# EAGLE design FiftyOneFun (EAGLE 9.2.2)
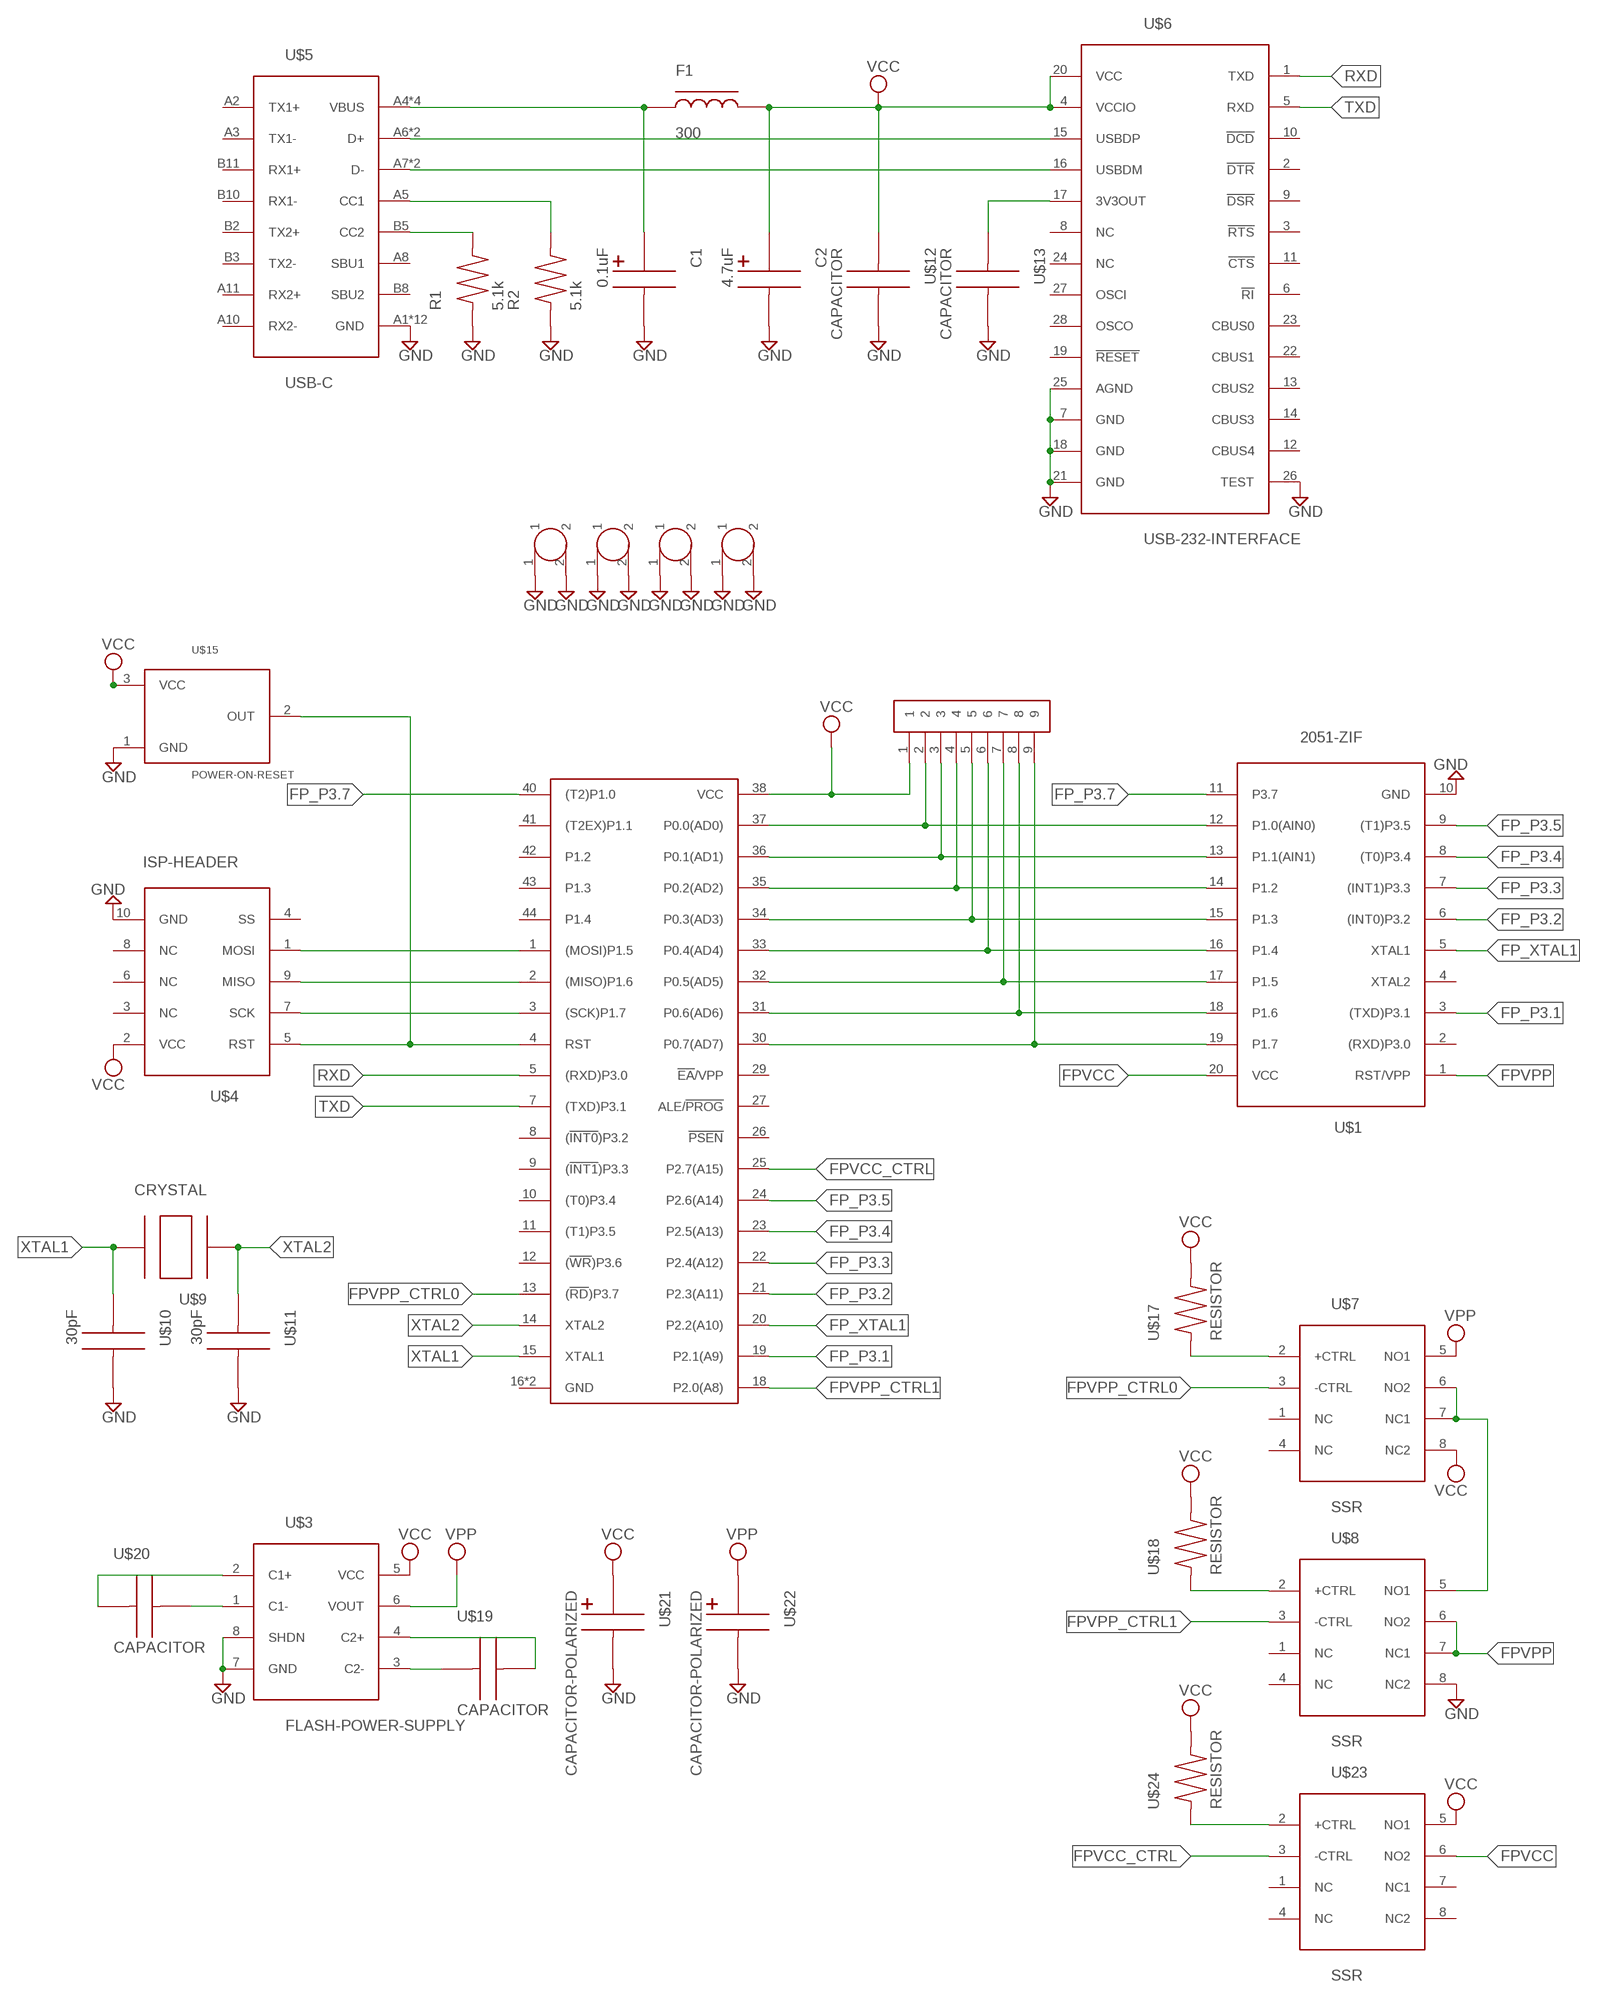
[diagram p0: schematic, sheet 1]

## Parts
C1  0.1uF  CAPACITOR-POLARIZED  [CAPACITOR-POLARIZED]
C2  4.7uF  CAPACITOR-POLARIZED  [CAPACITOR-POLARIZED]
F1  300  FERRITE-BEAD  [FERRITE-BEAD]
R1  5.1k  RESISTOR  [RESISTOR]
R2  5.1k  RESISTOR  [RESISTOR]
U$1  2051-ZIF  [2051-ZIF]
U$2  SIP-RESISTORS  [SIP-RESISTORS]
U$3  FLASH-POWER-SUPPLY  [FLASH-POWER-SUPPLY]
U$4  ISP-HEADER  [ISP-HEADER]
U$5  USB-C  [12401598E4#2A]
U$6  USB-232-INTERFACE  [USB-232-INTERFACE]
U$7  SSR  [SSR]
U$8  SSR  [SSR]
U$9  CRYSTAL  [CRYSTAL]
U$10  30pF  CAPACITOR  [CAPACITOR]
U$11  30pF  CAPACITOR  [CAPACITOR]
U$12  CAPACITOR  [CAPACITOR]
U$13  CAPACITOR  [CAPACITOR]
U$14  8052  [8052]
U$15  POWER-ON-RESET  [POWER-ON-RESET]
U$16  MOUNTING-HOLE  [MOUNTING-HOLE]
U$17  RESISTOR  [RESISTOR]
U$18  RESISTOR  [RESISTOR]
U$19  CAPACITOR  [CAPACITOR]
U$20  CAPACITOR  [CAPACITOR]
U$21  CAPACITOR-POLARIZED  [CAPACITOR-POLARIZED]
U$22  CAPACITOR-POLARIZED  [CAPACITOR-POLARIZED]
U$23  SSR  [SSR]
U$24  RESISTOR  [RESISTOR]
U$25  MOUNTING-HOLE  [MOUNTING-HOLE]
U$26  MOUNTING-HOLE  [MOUNTING-HOLE]
U$27  MOUNTING-HOLE  [MOUNTING-HOLE]

## Nets
FP_P3.1: U$1.3((TXD)P3.1) U$14.19(P2.1(A9))
FP_P3.2: U$1.6((INT0)P3.2) U$14.21(P2.3(A11))
FP_P3.3: U$1.7((INT1)P3.3) U$14.22(P2.4(A12))
FP_P3.4: U$1.8((T0)P3.4) U$14.23(P2.5(A13))
FP_P3.5: U$1.9((T1)P3.5) U$14.24(P2.6(A14))
FP_P3.7: U$1.11(P3.7) U$14.40((T2)P1.0)
FP_XTAL1: U$1.5(XTAL1) U$14.20(P2.2(A10))
FPD0: U$1.12(P1.0(AIN0)) U$2.2 U$14.37(P0.0(AD0))
FPD1: U$1.13(P1.1(AIN1)) U$2.3 U$14.36(P0.1(AD1))
FPD2: U$1.14(P1.2) U$2.4 U$14.35(P0.2(AD2))
FPD3: U$1.15(P1.3) U$2.5 U$14.34(P0.3(AD3))
FPD4: U$1.16(P1.4) U$2.6 U$14.33(P0.4(AD4))
FPD5: U$1.17(P1.5) U$2.7 U$14.32(P0.5(AD5))
FPD6: U$1.18(P1.6) U$2.8 U$14.31(P0.6(AD6))
FPD7: U$1.19(P1.7) U$2.9 U$14.30(P0.7(AD7))
FPVCC: U$1.20(VCC) U$23.6(NO2)
FPVCC_CTRL: U$14.25(P2.7(A15)) U$23.3(-CTRL)
FPVPP: U$1.1(RST/VPP) U$8.6(NO2) U$8.7(NC1)
FPVPP_CTRL0: U$7.3(-CTRL) U$14.13((!RD!)P3.7)
FPVPP_CTRL1: U$8.3(-CTRL) U$14.18(P2.0(A8))
GND: C1.2 C2.2 R1.1 R2.1 U$1.10(GND) U$3.7(GND) U$3.8(SHDN) U$4.10(GND) U$5.A1(GND) U$5.A12(GND) U$5.B1(GND) U$5.B12(GND) U$5.MOUNT_1_BOTTOM(GND) U$5.MOUNT_1_TOP(GND) U$5.MOUNT_2_BOTTOM(GND) U$5.MOUNT_2_TOP(GND) U$5.MOUNT_3_BOTTOM(GND) U$5.MOUNT_3_TOP(GND) U$5.MOUNT_4_BOTTOM(GND) U$5.MOUNT_4_TOP(GND) U$6.7(GND) U$6.18(GND) U$6.21(GND) U$6.25(AGND) U$6.26(TEST) U$8.8(NC2) U$10.2 U$11.2 U$12.2 U$13.2 U$15.1(GND) U$16.1 U$16.2 U$21.2 U$22.2 U$25.1 U$25.2 U$26.1 U$26.2 U$27.1 U$27.2
MISO: U$4.9(MISO) U$14.2((MISO)P1.6)
MOSI: U$4.1(MOSI) U$14.1((MOSI)P1.5)
N$3: U$3.1(C1-) U$20.2
N$4: U$3.3(C2-) U$19.1
N$5: U$3.4(C2+) U$19.2
N$6: R1.2 U$5.B5(CC2)
N$7: R2.2 U$5.A5(CC1)
N$9: U$3.2(C1+) U$20.1
N$10: U$5.A6(D+) U$5.B6(D+) U$6.15(USBDP)
N$11: U$5.A7(D-) U$5.B7(D-) U$6.16(USBDM)
N$12: U$6.17(3V3OUT) U$13.1
N$13: U$7.2(+CTRL) U$17.1
N$14: U$8.2(+CTRL) U$18.1
N$19: U$7.6(NO2) U$7.7(NC1) U$8.5(NO1)
N$31: U$23.2(+CTRL) U$24.1
RST: U$4.5(RST) U$14.4(RST) U$15.2(OUT)
RXD: U$6.1(TXD) U$14.5((RXD)P3.0)
SCK: U$4.7(SCK) U$14.3((SCK)P1.7)
TXD: U$6.5(RXD) U$14.7((TXD)P3.1)
VBUS: C1.1 F1.1 U$5.A4(VBUS) U$5.A9(VBUS) U$5.B4(VBUS) U$5.B9(VBUS)
VCC: C2.1 F1.2 U$2.1 U$3.5(VCC) U$4.2(VCC) U$6.4(VCCIO) U$6.20(VCC) U$7.8(NC2) U$12.1 U$14.38(VCC) U$15.3(VCC) U$17.2 U$18.2 U$21.1 U$23.5(NO1) U$24.2
VPP: U$3.6(VOUT) U$7.5(NO1) U$22.1
XTAL1: U$9.2 U$10.1 U$14.15(XTAL1)
XTAL2: U$9.1 U$11.1 U$14.14(XTAL2)
Unconnected: U$1.2((RXD)P3.0) U$1.4(XTAL2) U$4.3(NC) U$4.4(SS) U$4.6(NC) U$4.8(NC) U$5.A2(TX1+) U$5.A3(TX1-) U$5.A8(SBU1) U$5.A10(RX2-) U$5.A11(RX2+) U$5.B2(TX2+) U$5.B3(TX2-) U$5.B8(SBU2) U$5.B10(RX1-) U$5.B11(RX1+) U$6.2(!DTR) U$6.3(!RTS) U$6.6(!RI) U$6.8(NC) U$6.9(!DSR) U$6.10(!DCD) U$6.11(!CTS) U$6.12(CBUS4) U$6.13(CBUS2) U$6.14(CBUS3) U$6.19(!RESET) U$6.22(CBUS1) U$6.23(CBUS0) U$6.24(NC) U$6.27(OSCI) U$6.28(OSCO) U$7.1(NC) U$7.4(NC) U$8.1(NC) U$8.4(NC) U$14.8((!INT0!)P3.2) U$14.9((!INT1!)P3.3) U$14.10((T0)P3.4) U$14.11((T1)P3.5) U$14.12((!WR!)P3.6) U$14.16(GND) U$14.17(GND) U$14.26(!PSEN) U$14.27(ALE/!PROG) U$14.29(!EA!/VPP) U$14.41((T2EX)P1.1) U$14.42(P1.2) U$14.43(P1.3) U$14.44(P1.4) U$23.1(NC) U$23.4(NC) U$23.7(NC1) U$23.8(NC2)

## Library data of the parts
C1 C2 U$21 U$22 = FiftyOneFunParts:CAPACITOR-POLARIZED
F1 = FiftyOneFunParts:FERRITE-BEAD
R1 R2 U$17 U$18 U$24 = FiftyOneFunParts:RESISTOR
U$1 = FiftyOneFunParts:2051-ZIF
U$2 = FiftyOneFunParts:SIP-RESISTORS
U$3 = FiftyOneFunParts:FLASH-POWER-SUPPLY
U$4 = FiftyOneFunParts:ISP-HEADER
U$5 = FiftyOneFunParts:USB-C
U$6 = FiftyOneFunParts:USB-232-INTERFACE
U$7 U$8 U$23 = FiftyOneFunParts:SSR
U$9 = FiftyOneFunParts:CRYSTAL
U$10-U$13 U$19 U$20 = FiftyOneFunParts:CAPACITOR
U$14 = FiftyOneFunParts:8052
U$15 = FiftyOneFunParts:POWER-ON-RESET
U$16 U$25-U$27 = FiftyOneFunParts:MOUNTING-HOLE

## Board
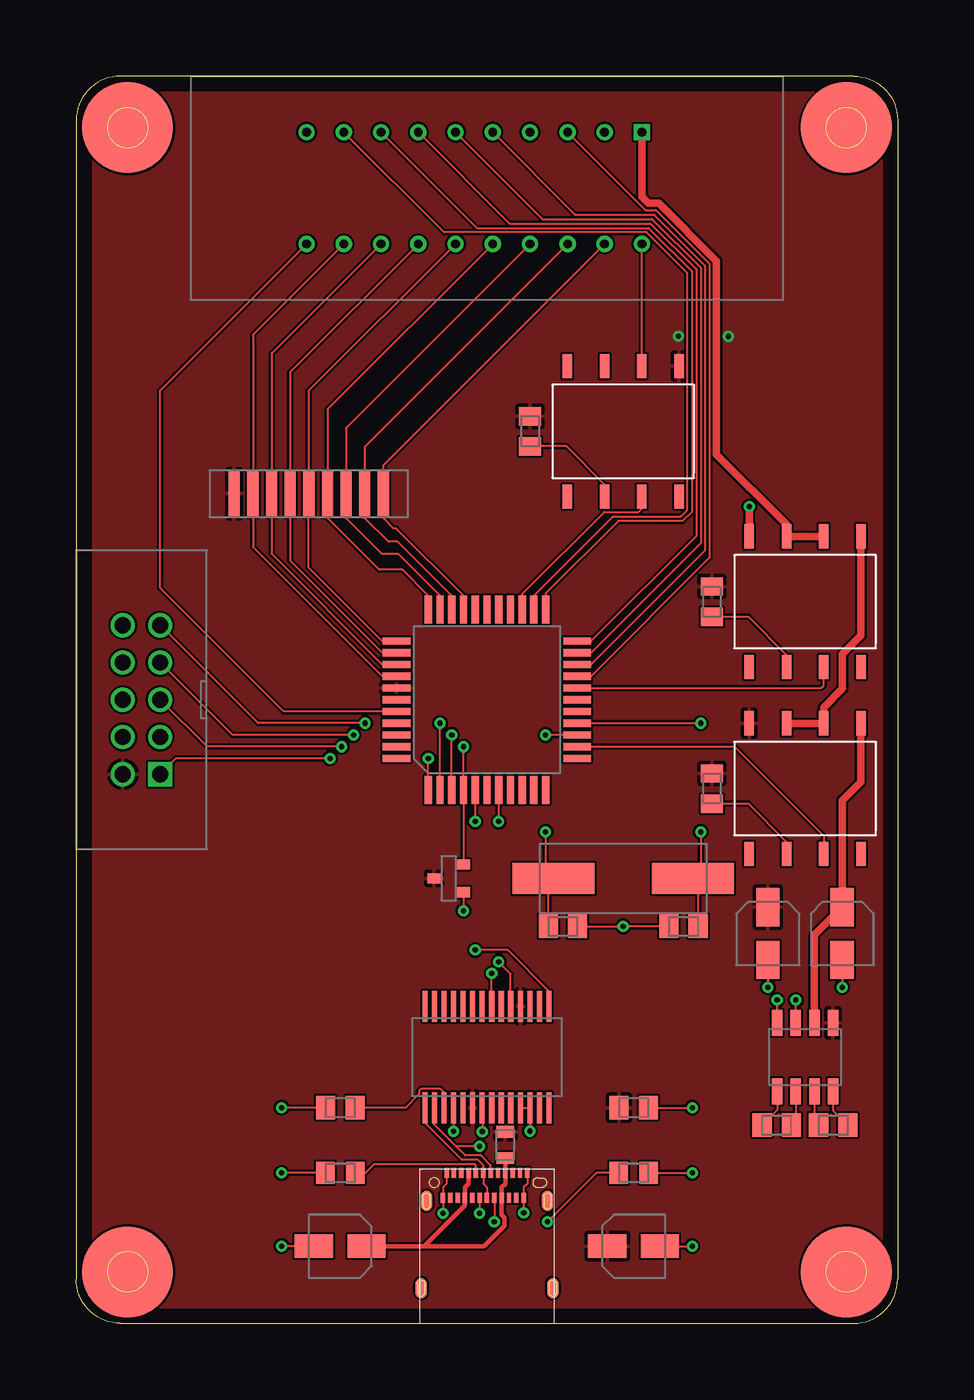
[diagram p1: board, top side]
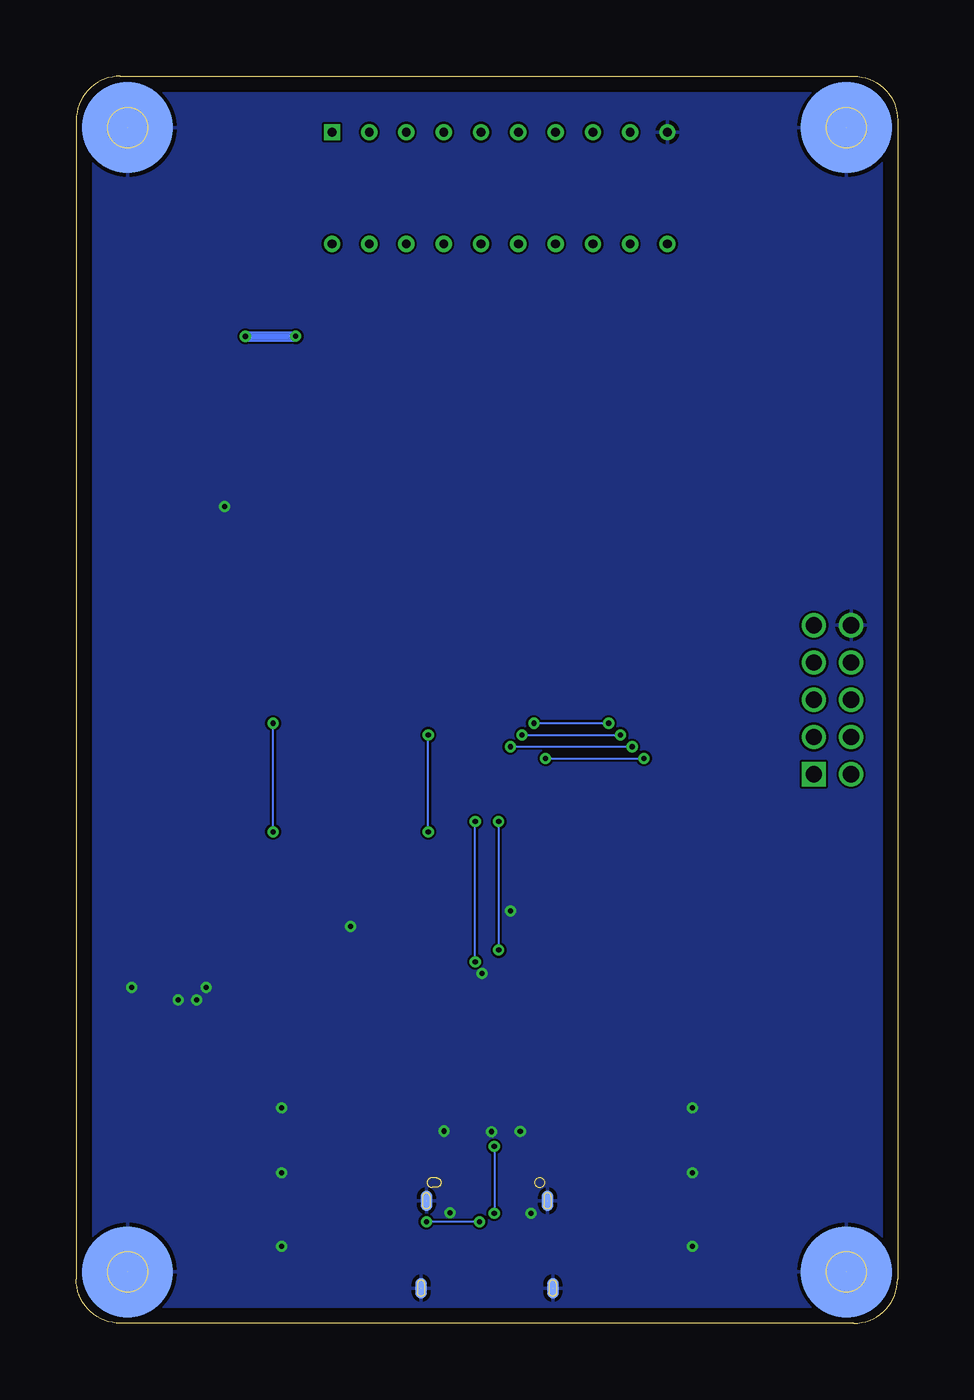
[diagram p2: board, bottom side, seen from below]

Size 56 x 85 mm. Coordinates in mm from the lower left corner, seen from the top.
Outline: 3,0 53,0 arc90 56,3 56,82 arc90 53,85 3,85 arc90 0,82 0,3 arc90 3,0
Copper layers (1*16): Top 0.035mm / dielectric 1.5mm / Bottom 0.035mm
Design rules "default": minimum track width 6mil, minimum drill 0.35mm, track to track 6mil, track to pad 6mil, pad to pad 6mil, via to via 6mil, smd to smd 6mil, copper to edge 40mil, drill to drill 6mil, minimum pad ring 10mil, minimum via ring 8mil, stop-mask expansion 4mil, vias tented up to drill 0mil, thermal gap 10mil

### Footprints (pad centres in the part's own frame; a part is rotated, then mirrored left to right if it is on the bottom)
CAPACITOR-POLARIZED = smd 2.6 x 1.6: 1 -1.8,0; 2 1.8,0
FERRITE-BEAD = smd 0.8 x 1.2: 1 -0.9,0; 2 0.9,0
RESISTOR = smd 1.25 x 1.5: 1 -1.025,0; 2 1.025,0
2051-ZIF = drill 0.6 square: 1 -10.56,-3.81 | drill 0.6: 2 -8.02,-3.81; 3 -5.5,-3.81; 4 -2.94,-3.81; 5 -0.4,-3.81; 6 2.14,-3.81; 7 4.68,-3.81; 8 7.22,-3.81; 9 9.76,-3.81; 10 12.3,-3.81; 11 12.3,3.81; 12 9.76,3.81; 13 7.22,3.81; 14 4.68,3.81; 15 2.14,3.81; 16 -0.4,3.81; 17 -2.94,3.81; 18 -5.5,3.81; 19 -8.02,3.81; 20 -10.56,3.81
SIP-RESISTORS = smd 0.76 x 3.18: 1 -5.08,0; 2 -3.81,0; 3 -2.54,0; 4 -1.27,0; 5 0,0; 6 1.27,0; 7 2.54,0; 8 3.81,0; 9 5.08,0
FLASH-POWER-SUPPLY = smd 0.72 x 1.78: 1 -1.905,-2.34; 2 -0.635,-2.34; 3 0.635,-2.34; 4 1.905,-2.34; 5 1.905,2.34; 6 0.635,2.34; 7 -0.635,2.34; 8 -1.905,2.34
ISP-HEADER = drill 1.1 square: 1 -5.08,-1.27 | drill 1.1: 2 -5.08,1.27; 3 -2.54,-1.27; 4 -2.54,1.27; 5 0,-1.27; 6 0,1.27; 7 2.54,-1.27; 8 2.54,1.27; 9 5.08,-1.27; 10 5.08,1.27
12401598E4#2A = smd 0.3 x 0.7: A1 -2.75,5; A2 -2.25,5; A3 -1.75,5; A4 -1.25,5; A5 -0.75,5; A6 -0.25,5; A7 0.25,5; A8 0.75,5; A9 1.25,5; A10 1.75,5; A11 2.25,5; A12 2.75,5; B1 2.5,3.3; B2 2,3.3; B3 1.5,3.3; B4 1,3.3; B5 0.5,3.3; B6 0,3.3; B7 -0.5,3.3; B8 -1,3.3; B9 -1.5,3.3; B10 -2,3.3; B11 -2.5,3.3; B12 -3,3.3 | smd 0.8 x 1.4 bottom: MOUNT_1_BOTTOM -4.49,-2.86; MOUNT_2_BOTTOM 4.49,-2.86; MOUNT_3_BOTTOM -4.13,3.09; MOUNT_4_BOTTOM 4.13,3.09 | smd 0.8 x 1.4: MOUNT_1_TOP -4.49,-2.86; MOUNT_2_TOP 4.49,-2.86; MOUNT_3_TOP -4.13,3.09; MOUNT_4_TOP 4.13,3.09
USB-232-INTERFACE = smd 0.35 x 2.1: 1 -4.225,-3.45; 2 -3.575,-3.45; 3 -2.925,-3.45; 4 -2.275,-3.45; 5 -1.625,-3.45; 6 -0.975,-3.45; 7 -0.325,-3.45; 8 0.325,-3.45; 9 0.975,-3.45; 10 1.625,-3.45; 11 2.275,-3.45; 12 2.925,-3.45; 13 3.575,-3.45; 14 4.225,-3.45; 15 4.225,3.45; 16 3.575,3.45; 17 2.925,3.45; 18 2.275,3.45; 19 1.625,3.45; 20 0.975,3.45; 21 0.325,3.45; 22 -0.325,3.45; 23 -0.975,3.45; 24 -1.625,3.45; 25 -2.275,3.45; 26 -2.925,3.45; 27 -3.575,3.45; 28 -4.225,3.45
SSR = smd 0.65 x 1.65: 1 -3.81,-4.45; 2 -1.27,-4.45; 3 1.27,-4.45; 4 3.81,-4.45; 5 3.81,4.45; 6 1.27,4.45; 7 -1.27,4.45; 8 -3.81,4.45
CRYSTAL = smd 5.6 x 2.1: 1 -4.75,0; 2 4.75,0
CAPACITOR = smd 1.3 x 1.6: 1 -1,0; 2 1,0
8052 = smd 1.9 x 0.5: 1 -6.15,4; 2 -6.15,3.2; 3 -6.15,2.4; 4 -6.15,1.6; 5 -6.15,0.8; 6 -6.15,0; 7 -6.15,-0.8; 8 -6.15,-1.6; 9 -6.15,-2.4; 10 -6.15,-3.2; 11 -6.15,-4; 23 6.15,-4; 24 6.15,-3.2; 25 6.15,-2.4; 26 6.15,-1.6; 27 6.15,-0.8; 28 6.15,0; 29 6.15,0.8; 30 6.15,1.6; 31 6.15,2.4; 32 6.15,3.2; 33 6.15,4 | smd 0.5 x 1.9: 12 -4,-6.15; 13 -3.2,-6.15; 14 -2.4,-6.15; 15 -1.6,-6.15; 16 -0.8,-6.15; 17 0,-6.15; 18 0.8,-6.15; 19 1.6,-6.15; 20 2.4,-6.15; 21 3.2,-6.15; 22 4,-6.15; 34 4,6.15; 35 3.2,6.15; 36 2.4,6.15; 37 1.6,6.15; 38 0.8,6.15; 39 0,6.15; 40 -0.8,6.15; 41 -1.6,6.15; 42 -2.4,6.15; 43 -3.2,6.15; 44 -4,6.15
POWER-ON-RESET = smd 0.7 x 0.9: 1 -0.95,-1; 2 0.95,-1; 3 0,1
MOUNTING-HOLE = smd 6.2 x 6.2: 1 0,0 | smd 6.2 x 6.2 bottom: 2 0,0

### Placement (x,y rotation side)
C1  18,5.25 180 top
C2  38,5.25 0 top
F1  29.24,12.15 90 top
R1  38,10.25 180 top
R2  18,10.25 0 top
U$1  28,77.38 180 top
U$2  15.86,56.55 0 top
U$3  49.69,18.14 0 top
U$4  4.45,42.5 90 top
U$5  28,5.25 0 top
U$6  28,18.14 180 top
U$7  49.69,36.45 0 top
U$8  49.69,49.19 0 top
U$9  37.29,30.32 0 top
U$10  41.4,27.05 180 top
U$11  33.18,27.05 0 top
U$12  38,14.69 0 top
U$13  18,14.69 180 top
U$14  28,42.5 90 top
U$15  25.4,30.32 90 top
U$16  3.5,3.5 0 top
U$17  43.34,36.45 90 top
U$18  43.34,49.19 90 top
U$19  51.61,13.5 0 top
U$20  47.76,13.51 180 top
U$21  47.15,26.57 270 top
U$22  52.22,26.57 270 top
U$23  37.29,60.8 0 top
U$24  30.94,60.8 90 top
U$25  52.5,3.5 0 top
U$26  3.5,81.5 0 top
U$27  52.5,81.5 0 top

### Tracks (layer width: path | path; a pad name or v marks a point on that pad's centre or on a via)
FP_P3.1
  Top 0.152: U$1.3 38.81,75.88 39.51,75.88 43.18,72.21 43.18,52.18 35.1,44.1 U$14.19
FP_P3.2
  Top 0.152: U$1.6 31.78,75.27 39.26,75.27 42.57,71.96 42.57,53.17 35.1,45.7 U$14.21
FP_P3.3
  Top 0.152: U$1.7 29.55,74.97 39.13,74.97 42.27,71.83 42.27,53.67 35.09,46.5 U$14.22
FP_P3.4
  Top 0.152: U$1.8 27.31,74.66 39.01,74.66 41.96,71.71 41.96,55.3 41.34,54.69 36.96,54.69 32,49.73 U$14.23
FP_P3.5
  Top 0.152: U$14.24 31.2,49.6 36.59,54.99 41.22,54.99 41.65,55.43 41.65,56.42 41.66,56.42 41.66,71.58 38.88,74.36 25.07,74.36 U$1.9
FP_P3.7
  Top 0.152: U$14.40 14.13,41.7 5.71,50.12 5.71,63.59 U$1.11
FP_XTAL1
  Top 0.152: U$1.5 34.02,75.57 39.39,75.57 42.87,72.09 42.87,52.67 35.1,44.9 U$14.20
FPD0
  Top 0.152: U$1.12 12.04,67.38 U$2.2 12.04,52.92 20.86,44.1 21.79,44.1 21.82,44.07 U$14.37
FPD1
  Top 0.152: 13.24,56.48 U$2.3 | U$1.13 13.31,66.11 U$2.3 | U$14.36 21.83,44.9 20.86,44.9 13.31,52.45 U$2.3
FPD2
  Top 0.152: 14.61,56.52 U$2.4 | U$1.14 14.59,64.83 U$2.4 | U$2.4 14.59,51.98 20.87,45.7 U$14.35
FPD3
  Top 0.152: U$1.15 15.86,63.56 U$2.5 15.86,51.51 20.86,46.5 U$14.34
FPD4
  Top 0.152: 24.04,48.69 U$14.33 24,49.6 22.24,51.36 20.66,51.36 17.12,54.89 U$2.6 17.12,62.3 U$1.16
FPD5
  Top 0.152: U$1.17 18.39,61.02 U$2.7 18.39,54.89 20.84,52.44 21.96,52.44 24.8,49.6 U$14.32
FPD6
  Top 0.152: U$1.18 19.66,59.73 U$2.8 19.66,54.89 21.27,53.28 21.92,53.28 25.6,49.6 U$14.31
FPD7
  Top 0.152: U$1.19 20.93,58.48 U$2.9 20.93,54.89 21.64,54.19 21.82,54.19 26.4,49.6 U$14.30
FPVCC
  Top 0.152: U$23.6 U$1.20
FPVCC_CTRL
  Top 0.152: U$23.3 38.56,55.52 38.33,55.3 36.01,55.3 30.4,49.69 U$14.25 30.4,49.6
FPVPP
  Top 0.152: 48.42,54.46 48.42,54.47
  Top 0.5: U$8.6 U$8.7 48.42,54.46 43.66,59.23 43.66,72.41 39.71,76.36 39.01,76.36 38.56,76.81 U$1.1
FPVPP_CTRL0
  Top 0.152: U$14.13 44.88,39.3 50.95,33.23 U$7.3
FPVPP_CTRL1
  Top 0.152: U$14.18 50.77,43.3 50.95,43.48 U$8.3
GND  (via drill 0.35)  (8 unrouted)
  Top 0.152: v45.88,55.66 | U$11.2 v37.29,27.05 | v37.29,27.05 | U$10.2 v37.29,27.05 | U$21.2 v47.15,22.9 | U$22.2 v52.22,22.9 | U$3.8 v47.78,22.03 | U$3.7 v49.05,22.02 v49.06,22.03 | U$15.1 v26.4,28.11 | U$6.7 28.32,23.62 v28.33,23.84 | v30.93,13.1 v30.93,13.11 U$6.26 U$6.25 | U$6.21 v27.68,13.06 | U$6.18 v25.73,13.1 v25.73,13.09 | v25.01,7.5 v25,7.51 U$5.B12 25,9.26 25.25,9.51 U$5.A1 | v30.51,7.53 v30.5,7.54 U$5.B1 30.5,9.26 30.75,9.51 U$5.A12 | C2.2 v42,5.25 | C1.2 v14,5.25 | U$13.2 v14,14.69 | R2.1 v14,10.25 | U$12.2 v42,14.69 | R1.1 v42,10.25
  Top 0.5: U$8.8 v45.88,55.66
  pour Bottom: 1,1 55,1 55,84 1,84
MISO  (via drill 0.35)
  Top 0.152: U$14.2 v24.8,40.9 | v19.7,40.9 12.39,40.9 U$4.9
  Bottom 0.152: v24.8,40.9 v19.7,40.9
MOSI  (via drill 0.35)
  Top 0.152: U$14.1 v24,38.5 | v17.3,38.5 6.79,38.5 U$4.1
  Bottom 0.152: v24,38.5 v17.3,38.5
N$3
  Top 0.152: U$3.1 47.78,14.53 U$20.2
N$4
  Top 0.152: U$3.3 50.32,13.79 U$19.1
N$5
  Top 0.152: U$3.4 51.59,14.52 U$19.2
N$6  (via drill 0.35)
  Top 0.152: U$5.B5 v28.5,6.92 | v32.13,6.92 35.46,10.25 R1.2
  Bottom 0.152: v28.5,6.92 v32.13,6.92
N$7
  Top 0.152: U$5.A5 27.25,10.76 27.18,10.83 20.3,10.83 19.72,10.25 R2.2
N$9
  Top 0.152: U$3.2 49.05,13.8 U$20.1
N$10
  Top 0.152: U$6.15 23.77,13.66 26.31,11.13 27.39,11.13 27.75,10.77 U$5.A6 27.75,9.51 28,9.26 U$5.B6
N$11  (via drill 0.35)
  Top 0.152: U$5.A7 28.25,10.78 27.59,11.44 26.52,11.44 25.93,12.04 | 25.93,12.04 24.43,13.54 U$6.16 | U$5.B7 v27.5,7.5 | v27.5,12.05 25.94,12.05 25.93,12.04
  Bottom 0.152: v27.5,12.05 v27.5,7.5
N$12
  Top 0.152: U$6.17 25.07,15.73 25.08,15.74 24.85,15.97 23.5,15.97 23.37,15.84 23.37,15.62 22.44,14.69 U$13.1
N$13
  Top 0.152: U$7.2 48.42,32.82 | 48.42,32.82 48.42,32.83 | U$17.1 45.82,35.42 48.42,32.82
N$14
  Top 0.152: U$8.2 48.42,45.56 45.82,48.16 U$18.1
N$19
  Top 0.5: U$7.7 U$7.6 50.96,41.98 52.24,43.26 52.24,45.61 53.5,46.87 U$8.5
N$31
  Top 0.152: U$23.2 36.02,57.17 33.42,59.77 U$24.1
RST  (via drill 0.35)
  Top 0.152: U$15.2 26.4,31.04 U$14.4 v26.4,39.3 | v18.1,39.3 8.91,39.3 U$4.5
  Bottom 0.152: v26.4,39.3 v18.1,39.3
RXD  (via drill 0.35)
  Top 0.152: U$6.1 32.23,22.64 29.42,25.44 v27.2,25.44 | U$14.5 v27.2,34.2
  Bottom 0.152: v27.2,34.2 v27.2,25.44
SCK  (via drill 0.35)
  Top 0.152: U$14.3 v25.6,40.1 | v18.9,40.1 10.65,40.1 U$4.7
  Bottom 0.152: v25.6,40.1 v18.9,40.1
TXD  (via drill 0.35)
  Top 0.152: U$6.5 29.62,22.64 29.62,23.82 v28.8,24.64 | U$14.7 v28.8,34.2
  Bottom 0.152: v28.8,24.64 v28.8,34.2
VBUS
  Top 0.152: F1.1
  Top 0.3: F1.1 U$5.A9 29.25,9.51 29,9.26 U$5.B4 29,7.38 29.18,7.2 29.18,6.64 27.79,5.25 23.72,5.25 | U$5.A4 26.75,9.51 26.5,9.26 U$5.B9 26.5,8.03 25.69,7.22 23.72,5.25 | C1.1 23.72,5.25
VCC  (via drill 0.35)
  Bottom 0.7: v44.47,67.27 41.05,67.27 v41.04,67.28
  pour Top: 1,1 55,1 55,84 1,84
VPP
  Top 0.152: 53.48,40.88 U$7.5
  Top 0.5: 53.48,40.88 53.48,36.9 52.22,35.65 U$22.1 50.32,26.46 U$3.6
XTAL1  (via drill 0.35)
  Top 0.152: U$10.1 42.4,29.96 42.15,30.22 | 42.15,30.22 U$9.2 | v42.58,33.5 42.58,30.65 42.15,30.22 | U$14.15 v42.58,40.9
  Bottom 0.152: v42.58,33.5 v42.58,40.9
XTAL2  (via drill 0.35)
  Top 0.152: U$11.1 32.18,29.96 U$9.1 32,30.86 v32,33.5 | U$14.14 v32,40.1
  Bottom 0.152: v32,33.5 v32,40.1